# EAGLE design Power Supply Rev G (EAGLE 9.6.2)
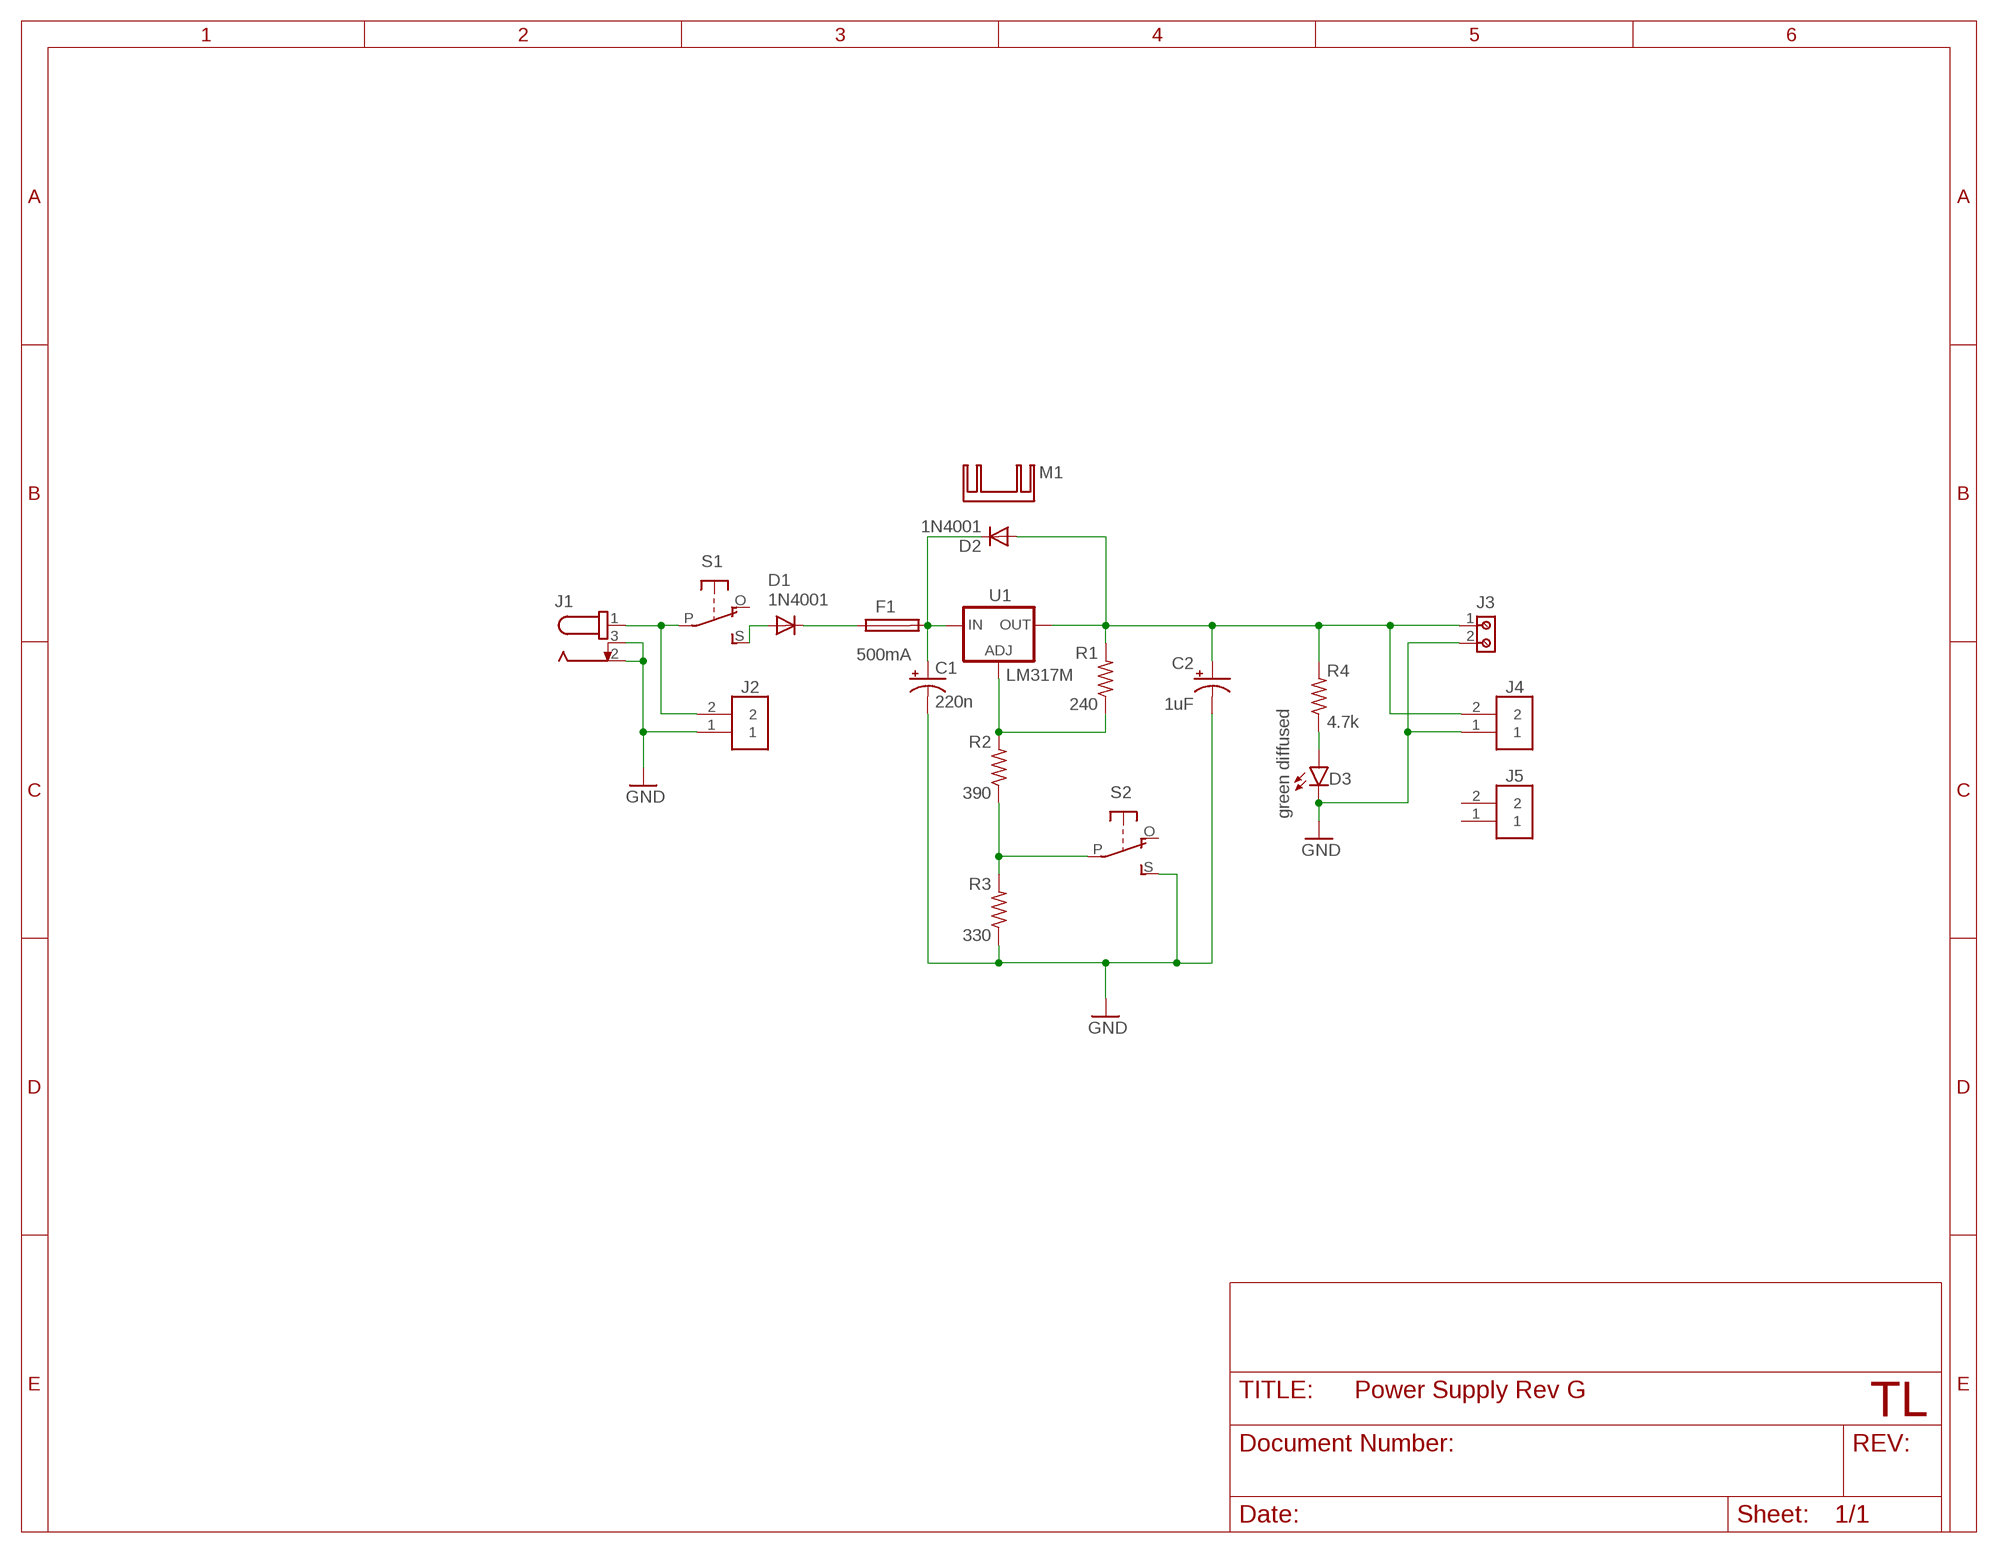
[diagram p0: schematic, sheet 1]

## Parts
C1  220n  E-CAPACITOR2-4  [E2-4]
C2  1uF  E-CAPACITOR2-4  [E2-4]
D1  1N4001  1N4000  [DO41-10]
D2  1N4001  1N4000  [DO41-10]
D3  green diffused  LED  [LED5MM]
F1  500mA  PTC-FUSE  [PTC-FUSE]
J1  694106301002  [694106301002]
J2  61300211121  [61300211121]
J3  691214110002  [691214110002]
J4  61300211121  [61300211121]
J5  61300211121  [61300211121]
M1  TO220-HEATSINK  [D03S]
R1  240  RESISTOR  [0207/10]
R2  390  RESISTOR  [0207/10]
R3  330  RESISTOR  [0207/10]
R4  4.7k  RESISTOR  [0207/10]
S1  SLIDE-SWITCHSIDE  [EG1270-90]
S2  SLIDE-SWITCHSIDE  [EG1270-90]
U1  LM317  [317TS]

## Nets
GND: C1.- C2.- D3.K(C) J1.2 J1.3 J2.1 J3.2 J4.1 R3.1 S2.S
N$1: D1.A S1.S
N$2: J1.1 J2.2 S1.P
N$4: D1.C F1.1
N$5: C1.+ D2.C F1.2 U1.3(IN)
N$6: R1.1 R2.2 U1.1(ADJ)
N$7: C2.+ D2.A J3.1 J4.2 R1.2 R4.2 U1.2(OUT)
N$8: R2.1 R3.2 S2.P
N$9: D3.A R4.1
Unconnected: J5.1 J5.2 S1.O S2.O

## Notes on the sheet
- TL

## Library data of the parts
C1 C2 = Quantum Projects:E-CAPACITOR
D1 D2 = Quantum Projects:1N4000
D3 = Quantum Projects:LED
F1 = Quantum Projects:PTC-FUSE
J1 = DC Power Jacks:694106301002: CONN PWR JACK 2.1X5.5MM SOLDER Manufacturer's datasheet <https://katalog.we-online.de/em/datasheet/6941xx301002.pdf>; CREATED_BY: PCBLayout.com; DIGIKEY_PART_NUMBER: 732-5930-ND; MANUFACTURER: Wurth Electronics Inc.; MPN: 694106301002
J2 J4 J5 = Headers:61300211121: CONN HEADER VERT 2POS 2.54MM Manufacturer's datasheet <https://katalog.we-online.de/em/datasheet/6130xx11121.pdf>; CREATED_BY: PCBLayout.com; DIGI_KEY_PART_NUMBER: 732-5315-ND; MANUFACTURER: Wurth Electronics Inc.; MPN: 61300211121
J3 = Wurth_Connectors_WR-TBL Rising Cage Clamp:691214110002: WR-TBL Serie 2141 - 3.50 mm Horiz. Entry Modular KIND PROPERTIES Pitch 3.5 mm MATERIAL PROPERTIES Insulator Material PA66 Insulator Flammability Rating UL94 V-0 Insulator Color Green Contact Material Brass Contact Plating Copper over Zinc Terminal Screw Material Steel Terminal Screw Plating Zinc Wire Guard Material Brass GENERAL INFORMATION Operating Temperature -40 up to +105 °C Compliance Lead free / RoHS ELECTRICAL PROPERTIES IR cULus 10 A Working Voltage [cULus] 300 V (AC) Withstanding Voltage [cULus] 1600 V (AC) Contact Resistance [cULus] 20 mΩ MECHANICAL PROPERTIES Wire Strip Length 5 up to 6 (mm) Screw M2 Solid Wire Section (AWG) 24 to 16 (AWG) Solid Wire Section (Metric) 0.205 to 1.31 (mm²) Stranded Wire Section (AWG) 24 to 16 (AWG) Stranded Wire Section (Metric) 0.205 to 1.31 (mm²) CERTIFICATION cULus Approval E315414 PACKAGING PROPERTIES Packaging Box <https://katalog.we-online.com/media/images/v2/o32858v209%20Family_WR-TBL2_Series2141S.jpg> Details see: https://katalog.we-online.com/en/em/TBL_3_50_2141_HORIZONTAL_ENTRY_MODULAR_69121411000X Updated by Ella Wu 2019-11-12 2019(C) Wurth Elektronik; DATASHEET-URL: https://www.we-online.com/catalog/datasheet/691214110002.pdf; IR-UL: 10A; MOUNT: THT; PART-NUMBER: 691214110002; PINS: 2; PITCH: 3.5mm; TYPE: Horizontal; WIRE: 24 to 16 (AWG) 0.205 to 1.31 (mm²); WORKING-VOLTAGE-UL: 300V (AC)
M1 = Quantum Projects:TO220-HEATSINK
R1-R4 = Quantum Projects:RESISTOR
S1 S2 = Quantum Projects:SLIDE-SWITCH
U1 = Quantum Projects:LM317; PARTNUMBER: LM317M

## Board
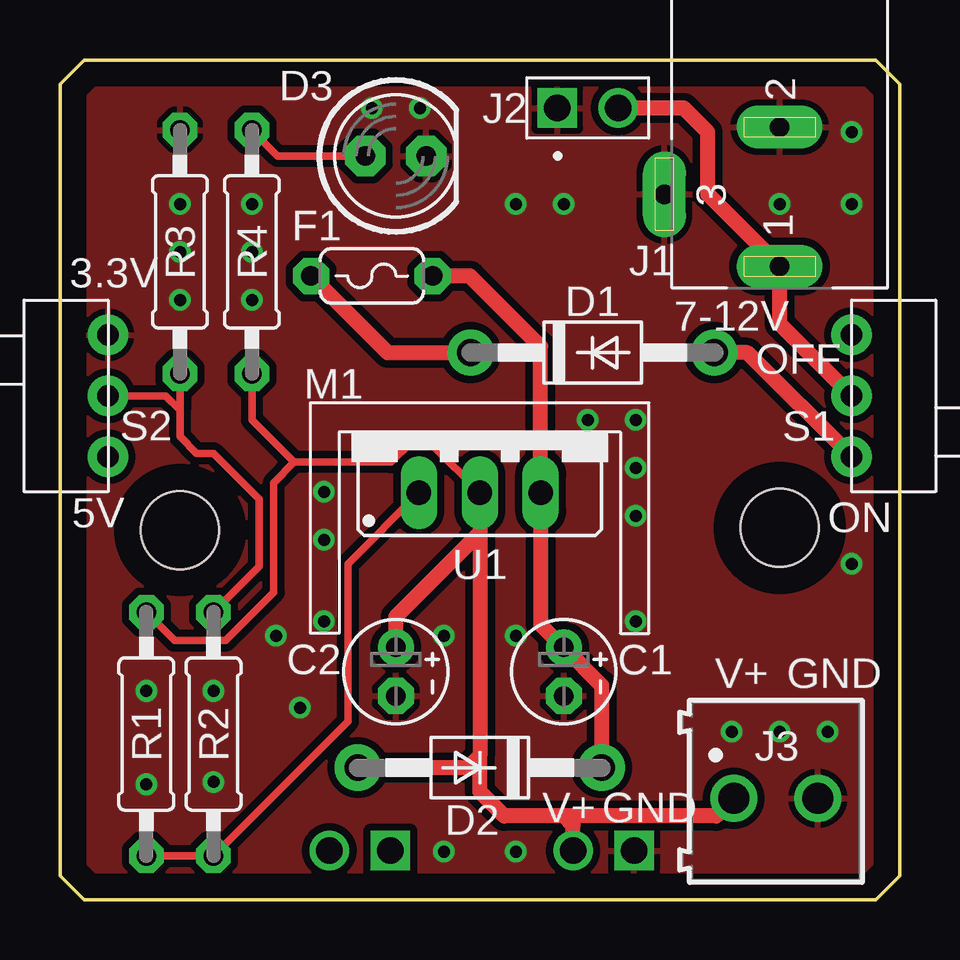
[diagram p1: board, top side]
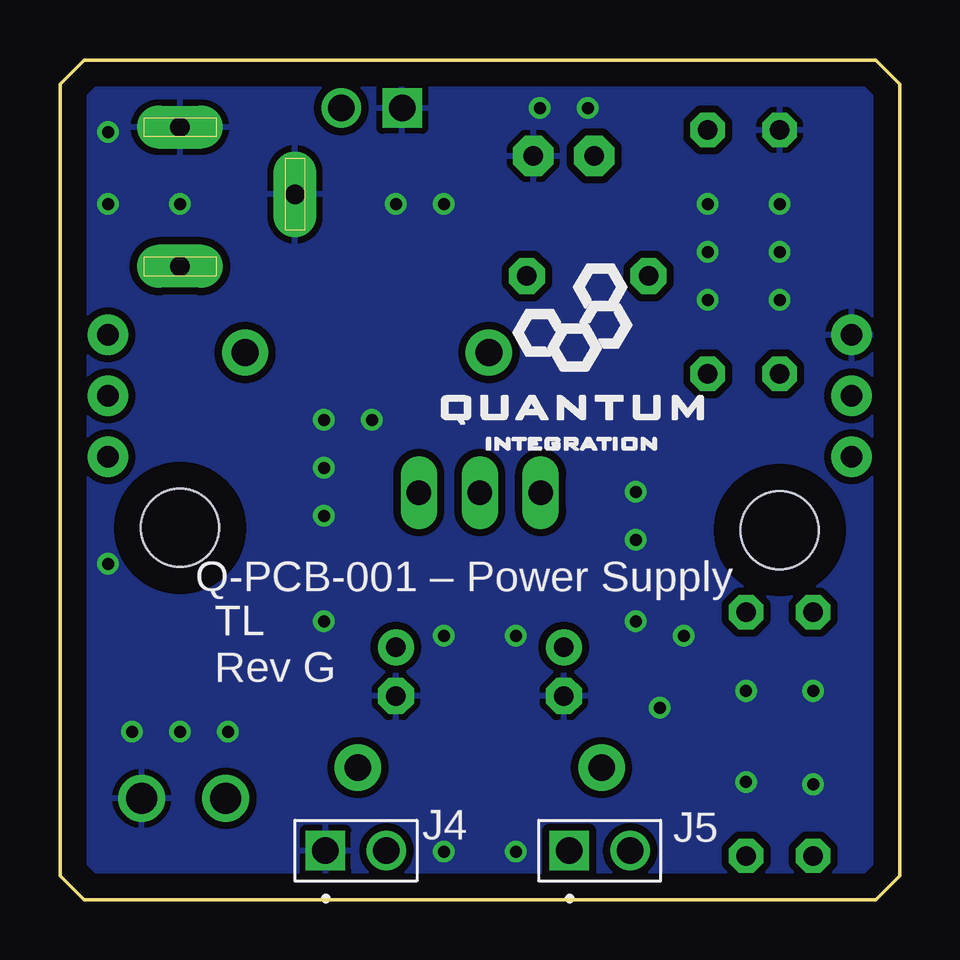
[diagram p2: board, bottom side, seen from below]

Size 35 x 35 mm. Coordinates in mm from the lower left corner, seen from the top.
Outline: 0,1 0,34 1,35 34,35 35,34 35,1 34,0 1,0 0,1
Copper layers (1*16): Top 0.035mm / dielectric 1.5mm / Bottom 0.035mm
Design rules "quantum-drc": minimum track width 12mil, minimum drill 0.35mm, track to track 12mil, track to pad 8mil, pad to pad 12mil, via to via 10mil, smd to smd 6mil, copper to edge 40mil, drill to drill 6mil, minimum pad ring 10mil, minimum via ring 8mil, stop-mask expansion 4mil, vias tented up to drill 50mil, thermal gap 10mil
Holes 3.25 mm at 30,15.5 5,15.4
tRestrict: area 27.2,12.8 to 32.8,18.2; area 2.2,12.7 to 7.8,18.1
bRestrict: area 2.2,12.7 to 7.8,18.1; area 27.2,12.8 to 32.8,18.2

### Footprints (pad centres in the part's own frame; a part is rotated, then mirrored left to right if it is on the bottom)
E2-4 = drill 0.813 pad 1.5: + -1.016,0 | drill 0.813 pad 1.5 octagon: - 1.016,0
DO41-10 = drill 1.118 pad 1.93: A 5.08,0; C -5.08,0
LED5MM = drill 0.813 pad 1.676 octagon: A -1.27,0; K 1.27,0
PTC-FUSE = drill 0.813 pad 1.5 octagon: 1 -2.54,0; 2 2.54,0
694106301002 = drill 0.8 pad 1.8 long: 1 13.6,0; 2 7.8,0; 3 10.6,-4.8
61300211121 = drill 1.1 square: 1 -1.27,0 | drill 1.1: 2 1.27,0
691214110002 = drill 1.3: 1 -1.75,0; 2 1.75,0
0207/10 = drill 0.813 pad 1.43 octagon: 1 -5.08,0; 2 5.08,0
EG1270-90 = drill 0.9 pad 1.676: O -2.54,0; P 0,0; S 2.54,0
317TS = drill 1.016 long: 1 -2.54,-2.54; 2 0,-2.54; 3 2.54,-2.54

### Placement (x,y rotation side)
C1  21,9.5 270 top
C2  14,9.5 270 top
D1  22.2,22.8 0 top
D2  17.5,5.5 180 top
D3  14,31 0 top
F1  13,26 0 top
J1  30,40 270 top
J2  22,33 0 top
J3  29.84,4.22 0 top
J4  22.66,2.04 0 bottom
J5  12.5,2.04 0 bottom
M1  17.5,19.5 180 top
R1  3.6,6.9 90 top
R2  6.4,6.9 270 top
R3  5,27 270 top
R4  8,27 270 top
S1  33,21 270 top
S2  2,21 90 top
U1  17.5,19.5 0 top

### Tracks (layer width: path | path; a pad name or v marks a point on that pad's centre or on a via)
GND  (via drill 0.5)
  other vias: 28,7 30,7 32,7 9,11 6.4,4.9 6.4,8.7 3.6,8.7 3.6,4.8 5,25 5,29 5,27 8,27 8,25 8,29 30,29 33,29 33,32 10,8 19,29 21,29 13,33 15,33 16,2 19,2 19,11 16,11 33,14 24,16 24,18 24,20 22,20 11,17 11,15 11,11.6 24,11.6
  pour Bottom: 1,0 0,1 0,34 1,35 34,35 35,34 35,1 34,0
  pour Top: 0,34 1,35 34,35 35,34 35,1 34,0 1,0 0,1
N$1
  Top 0.635: S1.S 28.66,22.8 D1.A
N$2
  Top 0.635: J2.2 26,33 27,32 27,29.4 J1.1 30,24 S1.P
N$4
  Top 0.635: F1.1 13.66,22.8 D1.C
N$5
  Top 0.635: D2.C 22.58,8.94 C1.+ 20.04,11.48 U1.3 20.04,23.06 17.1,26 F1.2
N$6
  Top 0.305: U1.1 12,14 12,7.42 R2.2 R1.1
N$7
  Top 0.305: 9.77,18.23 13.8,18.23 14.57,19 15.46,19 U1.2 | R4.2 8,20 9.77,18.23 | R1.2 4.78,10.8 6.9,10.8 8.91,12.81 8.91,17.37 9.77,18.23
  Top 0.635: U1.2 17.5,15.3 | 17.5,15.3 17.5,6 | J3.1 27.36,3.49 21,3.49 | 17.5,6 17,5.5 D2.A | 17.5,6 17.5,4.5 18.51,3.49 21,3.49 | J4.2 21.39,3.1 21,3.49 | C2.+ 14,11.8 17.5,15.3
N$8
  Top 0.305: R3.2 5,20.4 | 5,20.4 5,19.3 5.7,18.6 6.4,18.6 8.3,16.7 8.3,13.88 R2.1 | S2.P 4.4,21 5,20.4
N$9
  Top 0.305: D3.A 9.08,31 R4.1

### Text on the board
tNames: 3.3V | 7-12V | OFF | 5V | ON | V+ | GND | V+ | GND
bNames: Q-PCB-001 – Power Supply | TL | Rev G